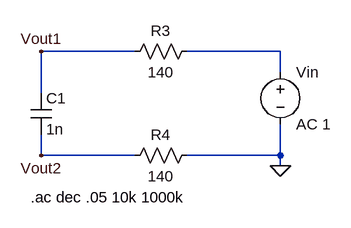
[diagram p0: schematic Cora Z7 VP-VN low-pass filter freq.asc]
Cora Z7 VP-VN low-pass filter freq.asc, the LTspice schematic file:
Version 4
SHEET 1 880 680
WIRE 144 192 0 192
WIRE 368 192 224 192
WIRE 368 224 368 192
WIRE 0 256 0 192
WIRE 0 352 0 320
WIRE 144 352 0 352
WIRE 368 352 368 304
WIRE 368 352 224 352
WIRE 368 368 368 352
FLAG 368 368 0
FLAG 0 192 Vout1
FLAG 0 352 Vout2
SYMBOL voltage 368 208 R0
WINDOW 123 0 0 Left 0
WINDOW 39 0 0 Left 0
SYMATTR InstName Vin
SYMATTR Value AC 1
SYMBOL res 240 176 R90
WINDOW 0 0 56 VBottom 2
WINDOW 3 32 56 VTop 2
SYMATTR InstName R3
SYMATTR Value 140
SYMBOL res 240 336 R90
WINDOW 0 0 56 VBottom 2
WINDOW 3 32 56 VTop 2
SYMATTR InstName R4
SYMATTR Value 140
SYMBOL cap -16 256 R0
SYMATTR InstName C1
SYMATTR Value 1n
TEXT -16 416 Left 2 !.ac dec .05 10k 1000k

The netlist it stands for:
* Cora Z7 VP-VN low-pass filter freq.asc
Vin N001 0 AC 1
R3 N001 Vout1 140
R4 0 Vout2 140
C1 Vout1 Vout2 1n
.ac dec .05 10k 1000k
.backanno
.end